# EAGLE design WiiMouseSchematicRev2 (EAGLE 5.07)

## Sheet 1 of 2
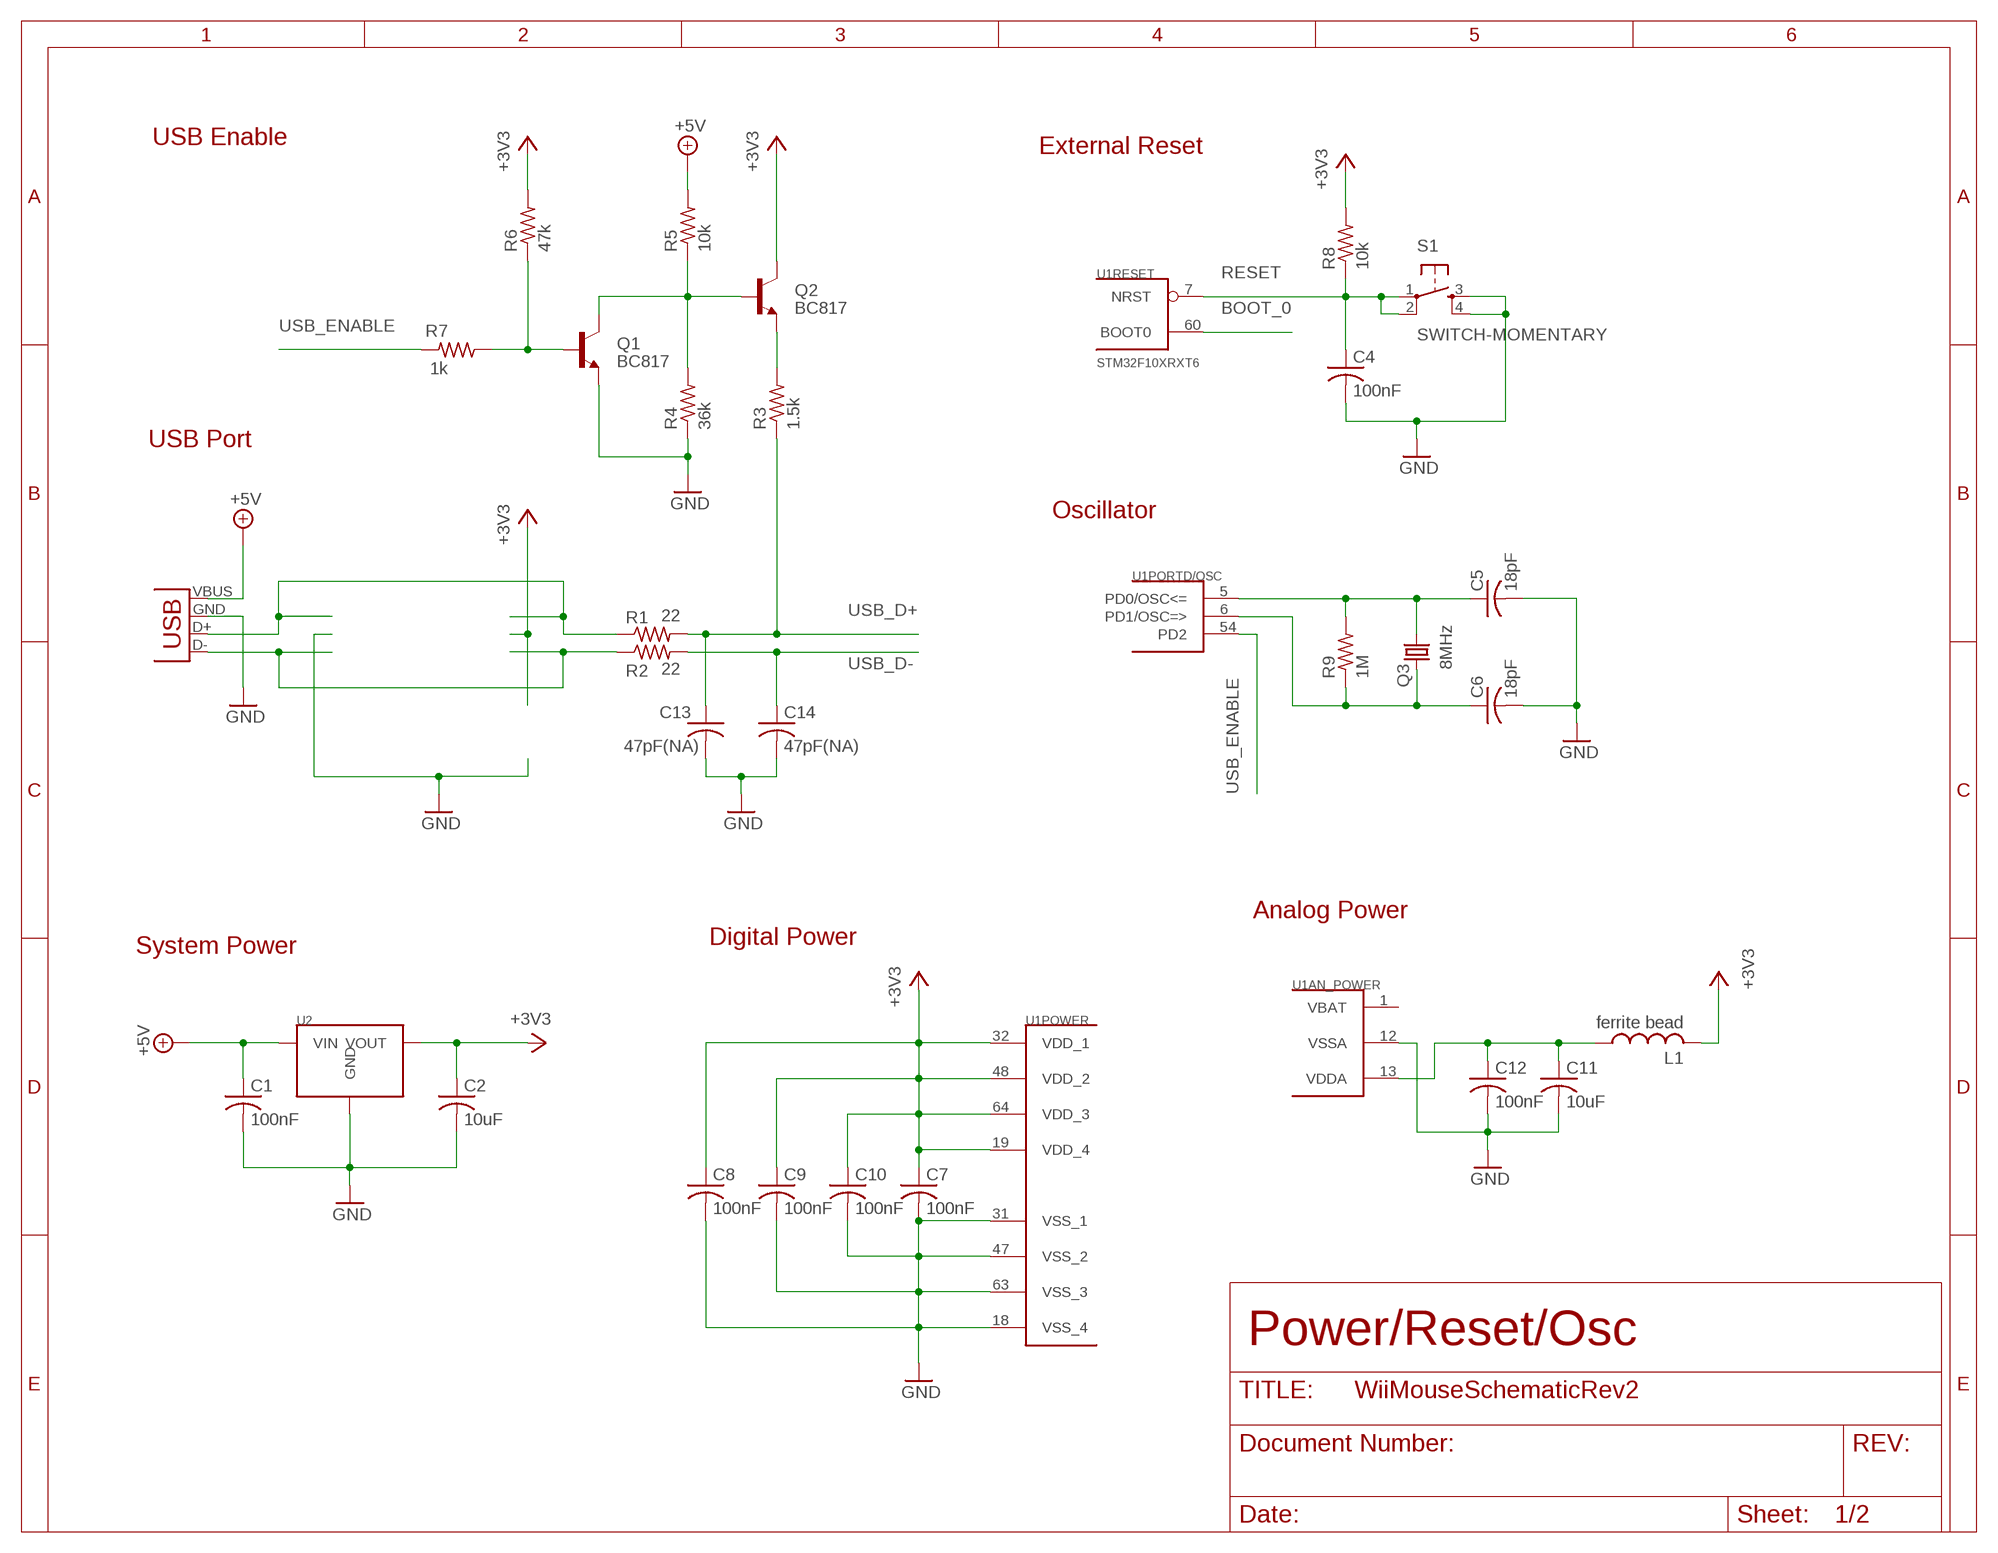
[diagram p0: schematic, sheet 1]

### Parts
C1  100nF  C-USC1206  [C1206]
C2  10uF  C-USC1206  [C1206]
C4  100nF  C-USC1206  [C1206]
C5  18pF  C-USC1206  [C1206]
C6  18pF  C-USC1206  [C1206]
C7  100nF  C-USC1206  [C1206]
C8  100nF  C-USC1206  [C1206]
C9  100nF  C-USC1206  [C1206]
C10  100nF  C-USC1206  [C1206]
C11  10uF  C-USC1206  [C1206]
C12  100nF  C-USC1206  [C1206]
C13  47pF(NA)  C-USC1206  [C1206]
C14  47pF(NA)  C-USC1206  [C1206]
L1  ferrite bead  L-USL3216C  [L3216C]
Q1  BC817  TRANSISTOR_NPNSOT23  [SOT23]
Q2  BC817  TRANSISTOR_NPNSOT23  [SOT23]
Q3  8MHz  CRYSTALHC49UP  [HC49UP]
R1  22  R-US_M1206  [M1206]
R2  22  R-US_M1206  [M1206]
R3  1.5k  R-US_M1206  [M1206]
R4  36k  R-US_M1206  [M1206]
R5  10k  R-US_M1206  [M1206]
R6  47k  R-US_M1206  [M1206]
R7  1k  R-US_M1206  [M1206]
R8  10k  R-US_M1206  [M1206]
R9  1M  R-US_M1206  [M1206]
S1  SWITCH-MOMENTARY  [PUSH-BTN]
U1  STM32F10XRXT6  [TQFP64]
U2  LD1117  [SOT-223]
X1  USB-A-H  [USB-A-H]

### Nets
+3V3: C2.1 C7.1 C8.1 C9.1 C10.1 L1.2 Q2.3(C) R6.2 R8.2 U1.19(POWER:VDD_4) U1.32(POWER:VDD_1) U1.48(POWER:VDD_2) U1.64(POWER:VDD_3) U2.2(VOUT) ; also sheet 2
+5V: C1.1 R5.2 U2.3(VIN) X1.VBUS(GND)
BOOT_0: U1.60(RESET:BOOT0) ; also sheet 2
GND: C1.2 C2.2 C4.2 C5.2 C6.2 C7.2 C8.2 C9.2 C10.2 C11.2 C12.2 C13.2 C14.2 Q1.2(E) R4.1 S1.3 S1.4 U1.12(AN_POWER:VSSA) U1.18(POWER:VSS_4) U1.31(POWER:VSS_1) U1.47(POWER:VSS_2) U1.63(POWER:VSS_3) U2.1(GND) X1.GND(VBUS) ; also sheet 2
N$1: R2.1 X1.D-(D+)
N$2: R1.1 X1.D+(D-)
N$3: Q2.2(E) R3.2
N$4: Q1.3(C) Q2.1(B) R4.2 R5.1
N$5: C5.1 Q3.2 R9.2 U1.5(PORTD/OSC:PD0/OSC<=)
N$6: Q1.1(B) R6.1 R7.1
N$7: C6.1 Q3.1 R9.1 U1.6(PORTD/OSC:PD1/OSC=>)
RESET: C4.1 R8.1 S1.1 S1.2 U1.7(RESET:NRST)
USB_D+: C13.1 R1.2 R3.1 ; also sheet 2
USB_D-: C14.1 R2.2 ; also sheet 2
USB_ENABLE: R7.2 U1.54(PORTD/OSC:PD2)
VDDA: C11.1 C12.1 L1.1 U1.13(AN_POWER:VDDA)

### Notes on the sheet
- USB Enable
- External Reset
- USB Port
- Oscillator
- Analog Power
- Digital Power
- System Power
- Power/Reset/Osc

## Sheet 2 of 2
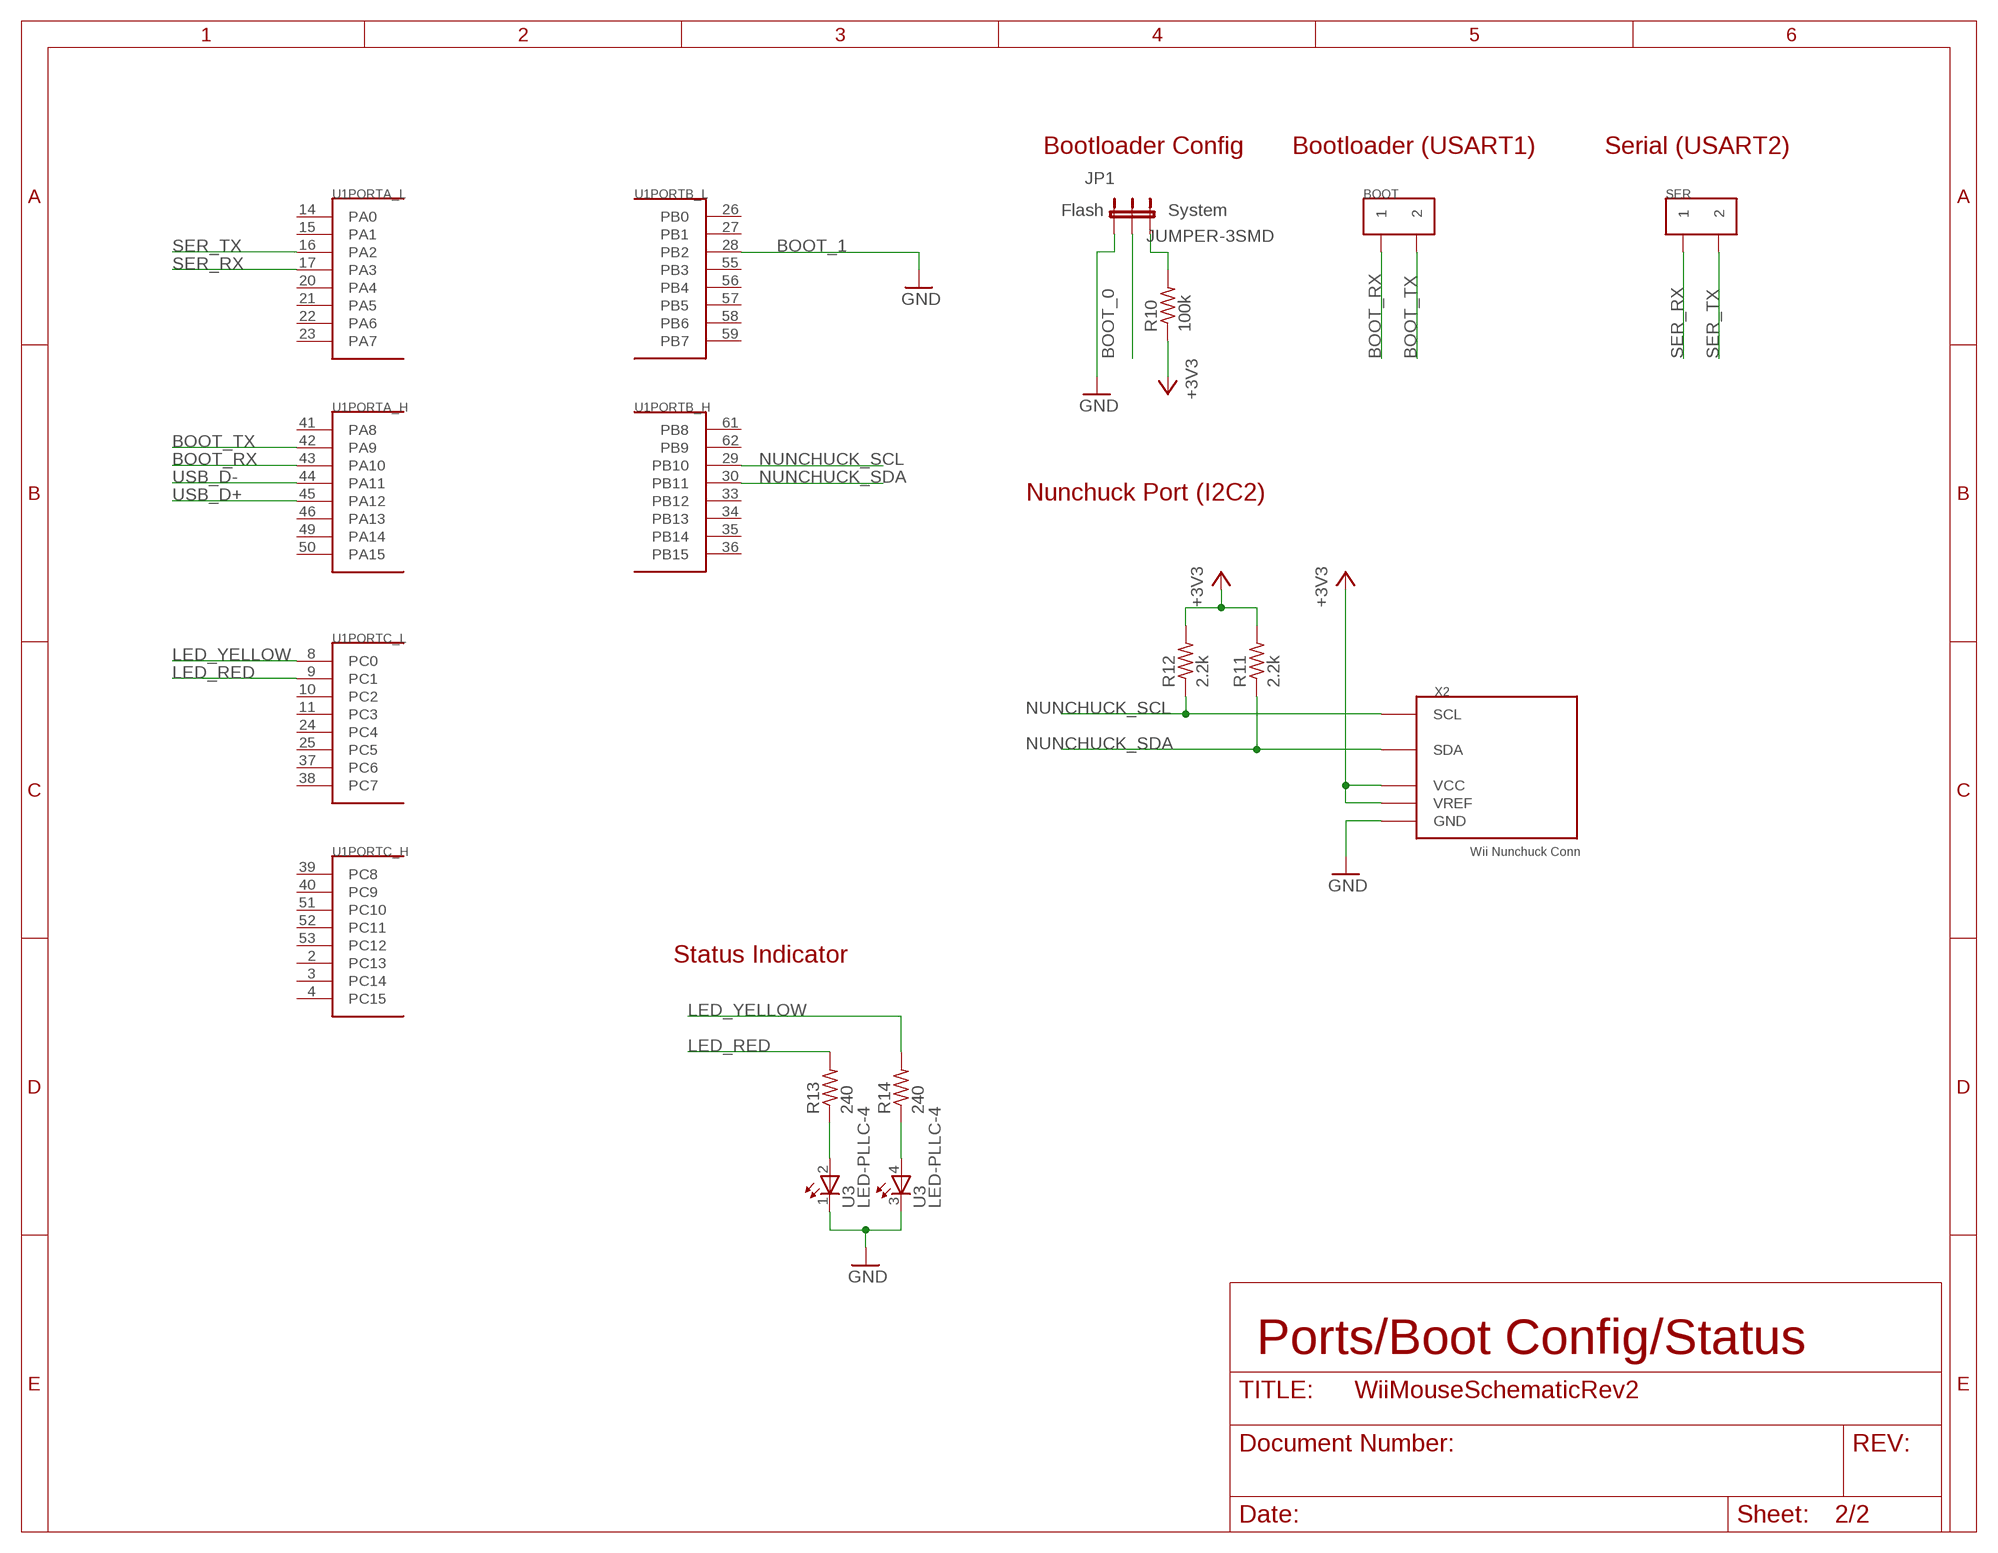
[diagram p1: schematic, sheet 2]

### Parts
BOOT  JUMPER-2-SMD  [JUMPER-2-SMD]
JP1  JUMPER-3SMD  [SJ_3]
R10  100k  R-US_M1206  [M1206]
R11  2.2k  R-US_M1206  [M1206]
R12  2.2k  R-US_M1206  [M1206]
R13  240  R-US_M1206  [M1206]
R14  240  R-US_M1206  [M1206]
SER  JUMPER-2-SMD  [JUMPER-2-SMD]
U3  LED-PLLC-4  [LED-PLCC-4]
X2  WII-NUNCHUCK  [CONN-WII-MOUSE]

### Nets
+3V3: R10.1 R11.2 R12.2 X2.REF_POS(VREF) X2.VCC ; also sheet 1
BOOT_0: JP1.2 ; also sheet 1
BOOT_RX: BOOT.P$1 U1.43(PORTA_H:PA10)
BOOT_TX: BOOT.P$2 U1.42(PORTA_H:PA9)
GND: JP1.1 U1.28(PORTB_L:PB2) U3.1 U3.3 X2.GND ; also sheet 1
LED_RED: R13.2 U1.9(PORTC_L:PC1)
LED_YELLOW: R14.2 U1.8(PORTC_L:PC0)
N$10: R13.1 U3.2
N$11: JP1.3 R10.2
N$12: R14.1 U3.4
NUNCHUCK_SCL: R12.1 U1.29(PORTB_H:PB10) X2.SCL
NUNCHUCK_SDA: R11.1 U1.30(PORTB_H:PB11) X2.SDA
SER_RX: SER.P$1 U1.17(PORTA_L:PA3)
SER_TX: SER.P$2 U1.16(PORTA_L:PA2)
USB_D+: U1.45(PORTA_H:PA12) ; also sheet 1
USB_D-: U1.44(PORTA_H:PA11) ; also sheet 1
Unconnected: U1.2(PORTC_H:PC13) U1.3(PORTC_H:PC14) U1.4(PORTC_H:PC15) U1.10(PORTC_L:PC2) U1.11(PORTC_L:PC3) U1.14(PORTA_L:PA0) U1.15(PORTA_L:PA1) U1.20(PORTA_L:PA4) U1.21(PORTA_L:PA5) U1.22(PORTA_L:PA6) U1.23(PORTA_L:PA7) U1.24(PORTC_L:PC4) U1.25(PORTC_L:PC5) U1.26(PORTB_L:PB0) U1.27(PORTB_L:PB1) U1.33(PORTB_H:PB12) U1.34(PORTB_H:PB13) U1.35(PORTB_H:PB14) U1.36(PORTB_H:PB15) U1.37(PORTC_L:PC6) U1.38(PORTC_L:PC7) U1.39(PORTC_H:PC8) U1.40(PORTC_H:PC9) U1.41(PORTA_H:PA8) U1.46(PORTA_H:PA13) U1.49(PORTA_H:PA14) U1.50(PORTA_H:PA15) U1.51(PORTC_H:PC10) U1.52(PORTC_H:PC11) U1.53(PORTC_H:PC12) U1.55(PORTB_L:PB3) U1.56(PORTB_L:PB4) U1.57(PORTB_L:PB5) U1.58(PORTB_L:PB6) U1.59(PORTB_L:PB7) U1.61(PORTB_H:PB8) U1.62(PORTB_H:PB9)

### Notes on the sheet
- Serial (USART2)
- Bootloader Config | Bootloader (USART1)
- Flash | System
- BOOT_1
- Nunchuck Port (I2C2)
- Status Indicator
- Ports/Boot Config/Status

## Power pins joined to a net without a drawn wire
VBAT: U1.1(AN_POWER:VBAT)

## Library data of the parts
BOOT SER = parts_library:JUMPER-2-SMD
C1 C2 C4-C14 = rcl:C-US: CAPACITOR, American symbol
JP1 = SparkFun:JUMPER-3
L1 = rcl:L-US: INDUCTOR, American symbol
Q1 Q2 = SparkFun:TRANSISTOR_NPN: Transistor NPN BJT configuration in SOT23 package. MMBT2222 is the common NPN we use. Double check BCE configuration again layout.
Q3 = crystal:CRYSTAL: CRYSTAL; OC_FARNELL: unknown; OC_NEWARK: unknown
R1-R14 = resistor:R-US_: RESISTOR, American symbol
S1 = parts_library:SWITCH-MOMENTARY
U1 = stm32:STM32F10XRXT6: STM32F101/103 64pin LQFP
U2 = parts_library:LD1117
U3 = parts_library:LED-PLLC-4
X1 = SparkFun:USB: USB Connectors USB-B-PTH is fully proven SKU : PRT-00139 USB-miniB is fully proven SKU : PRT-00587 USB-A-PCB is untested. USB-A-H is throughly reviewed, but untested. Spark Fun Electronics SKU : PRT-00437 USB-B-SMT is throughly reviewed, but untested. Needs silkscreen touching up. USB-A-S has not been used/tested USB-MB-H has not been used/tested
X2 = parts_library:WII-NUNCHUCK

## Board
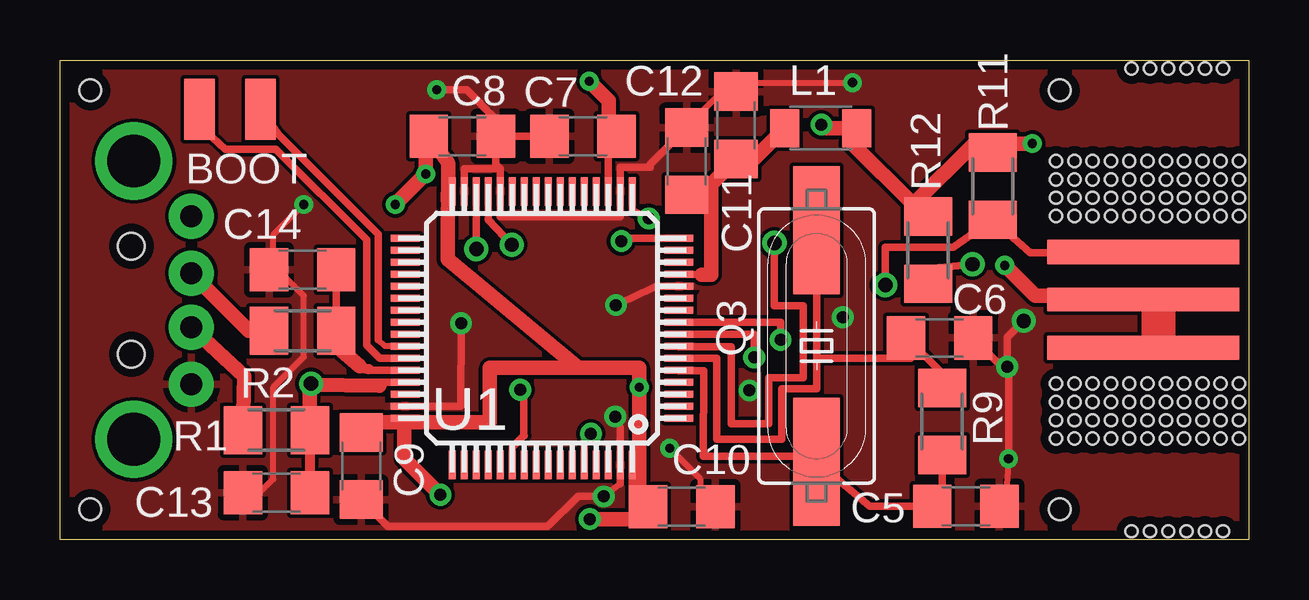
[diagram p2: board, top side]
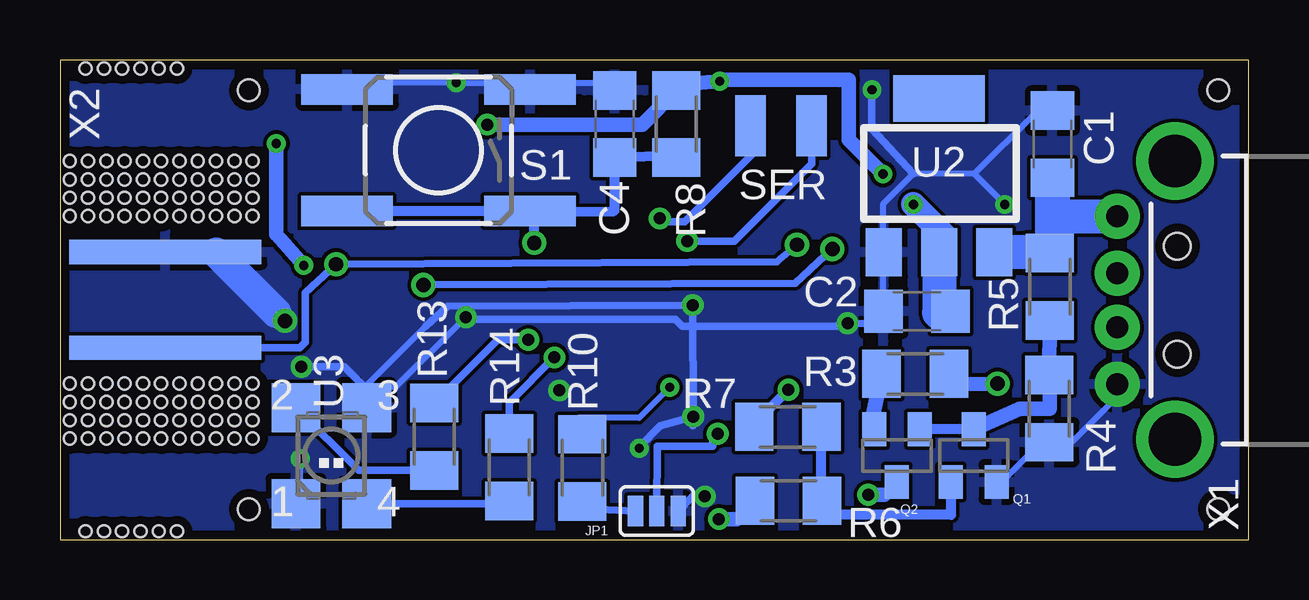
[diagram p3: board, bottom side, seen from below]

Size 49.53 x 19.99 mm. Coordinates in mm from the lower left corner, seen from the top.
Outline: 49.53,0 0,0 0,19.99 49.53,19.99 49.53,0
Copper layers (1*16): Top 0.0356mm / dielectric 1.5011mm / Bottom 0.0356mm
Design rules "typical_4pcb": minimum track width 10mil, minimum drill 15mil, track to track 6mil, track to pad 6mil, pad to pad 6mil, via to via 6mil, smd to smd 6mil, copper to edge 15mil, drill to drill 8mil, minimum pad ring 10mil, minimum via ring 8mil, stop-mask expansion 4mil, vias tented up to drill 0mil, thermal gap 10mil
Holes 0.9 mm at 1.27,18.72 1.27,1.27 41.66,1.27 41.66,18.72

### Footprints (pad centres in the part's own frame; a part is rotated, then mirrored left to right if it is on the bottom)
JUMPER-2-SMD = smd 1.27 x 2.54: P$1 -1.27,0; P$2 1.27,0
C1206 = smd 1.6 x 1.8: 1 -1.4,0; 2 1.4,0
SJ_3 = smd 0.635 x 1.27: 1 -0.889,0; 2 0,0; 3 0.889,0
L3216C = smd 1.2 x 1.6: 1 -1.5,0; 2 1.5,0
SOT23 = smd 1 x 1.4: 1 -0.95,-1.1; 2 0.95,-1.1; 3 0,1.1
HC49UP = smd 5.334 x 1.93: 1 -4.826,0; 2 4.826,0
M1206 = smd 1.6 x 2: 1 -1.4,0; 2 1.4,0
PUSH-BTN = smd 3.81 x 1.27: 1 -3.81,2.54; 2 3.81,2.54; 3 -3.81,-2.54; 4 3.81,-2.54
TQFP64 = smd 1.2 x 0.3: 1 -5.7,3.75; 2 -5.7,3.25; 3 -5.7,2.75; 4 -5.7,2.25; 5 -5.7,1.75; 6 -5.7,1.25; 7 -5.7,0.75; 8 -5.7,0.25; 9 -5.7,-0.25; 10 -5.7,-0.75; 11 -5.7,-1.25; 12 -5.7,-1.75; 13 -5.7,-2.25; 14 -5.7,-2.75; 15 -5.7,-3.25; 16 -5.7,-3.75; 33 5.7,-3.75; 34 5.7,-3.25; 35 5.7,-2.75; 36 5.7,-2.25; 37 5.7,-1.75; 38 5.7,-1.25; 39 5.7,-0.75; 40 5.7,-0.25; 41 5.7,0.25; 42 5.7,0.75; 43 5.7,1.25; 44 5.7,1.75; 45 5.7,2.25; 46 5.7,2.75; 47 5.7,3.25; 48 5.7,3.75 | smd 0.3 x 1.2: 17 -3.75,-5.7; 18 -3.25,-5.7; 19 -2.75,-5.7; 20 -2.25,-5.7; 21 -1.75,-5.7; 22 -1.25,-5.7; 23 -0.75,-5.7; 24 -0.25,-5.7; 25 0.25,-5.7; 26 0.75,-5.7; 27 1.25,-5.7; 28 1.75,-5.7; 29 2.25,-5.7; 30 2.75,-5.7; 31 3.25,-5.7; 32 3.75,-5.7; 49 3.75,5.7; 50 3.25,5.7; 51 2.75,5.7; 52 2.25,5.7; 53 1.75,5.7; 54 1.25,5.7; 55 0.75,5.7; 56 0.25,5.7; 57 -0.25,5.7; 58 -0.75,5.7; 59 -1.25,5.7; 60 -1.75,5.7; 61 -2.25,5.7; 62 -2.75,5.7; 63 -3.25,5.7; 64 -3.75,5.7
SOT-223 = smd 1.499 x 2.007: 1 -2.3,-3.235; 2 0,-3.235; 3 2.3,-3.235 | smd 3.81 x 1.93: 4 0,3.175
LED-PLCC-4 = smd 2.032 x 2.032: 1 -1.473,-2; 2 -1.473,2; 3 1.473,2; 4 1.473,-2
USB-A-H = drill 0.914 pad 1.88 round: D+ 2.4,1.127; D- 2.4,-1.127; GND 2.4,3.5; VBUS 2.4,-3.5 | drill 2.2 round: GND2 0,-5.8; GND3 0,5.8 | hole 1.1: -0.1,2.25; -0.1,-2.25
CONN-WII-MOUSE = smd 1.016 x 8.001: GND 11.989,-4.394; SCL 8.001,-4.394 | smd 0.991 x 8.001 bottom: REF_POS 10.008,-4.394 | smd 1.016 x 8.001 bottom: SDA 11.989,-4.394; VCC 8.001,-4.394 | hole 0.5: 5.74,-0.406; 6.502,-0.406; 0.356,-2.591; 0.356,-4.877; 0.356,-3.353; 0.356,-4.115; 4.978,-0.406; 4.216,-0.406; 5.74,-1.168; 6.502,-1.168; 4.978,-1.168; 4.216,-1.168; 5.74,-1.93; 6.502,-1.93; 4.978,-1.93; 4.216,-1.93; 5.74,-2.692; 6.502,-2.692; 4.978,-2.692; 4.216,-2.692; 5.74,-3.454; 6.502,-3.454; 4.978,-3.454; 4.216,-3.454; 5.74,-4.216; 6.502,-4.216; 4.978,-4.216; 4.216,-4.216; 5.74,-4.978; 6.502,-4.978; 4.978,-4.978; 4.216,-4.978; 5.74,-5.74; 6.502,-5.74; 4.978,-5.74; 4.216,-5.74; 5.74,-6.502; 6.502,-6.502; 4.978,-6.502; 4.216,-6.502; 5.74,-7.264; 6.502,-7.264; 4.978,-7.264; 4.216,-7.264; 5.74,-8.026; 6.502,-8.026; 4.978,-8.026; 4.216,-8.026; 15.011,-0.406; 15.773,-0.406; 14.249,-0.406; 13.487,-0.406; 15.011,-1.168; 15.773,-1.168; 14.249,-1.168; 13.487,-1.168; 15.011,-1.93; 15.773,-1.93; 14.249,-1.93; 13.487,-1.93; 15.011,-2.692; 15.773,-2.692; 14.249,-2.692; 13.487,-2.692; 15.011,-3.454; 15.773,-3.454; 14.249,-3.454; 13.487,-3.454; 15.011,-4.216; 15.773,-4.216; 14.249,-4.216; 13.487,-4.216; 15.011,-4.978; 15.773,-4.978; 14.249,-4.978; 13.487,-4.978; 15.011,-5.74; 15.773,-5.74; 14.249,-5.74; 13.487,-5.74; 15.011,-6.502; 15.773,-6.502; 14.249,-6.502; 13.487,-6.502; 15.011,-7.264; 15.773,-7.264; 14.249,-7.264; 13.487,-7.264; 15.011,-8.026; 15.773,-8.026; 14.249,-8.026; 13.487,-8.026; 19.634,-2.591; 19.634,-4.877; 19.634,-3.353; 19.634,-4.115; 0.356,-1.829; 0.356,-1.067; 19.634,-1.829; 19.634,-1.067

### Placement (x,y rotation side)
BOOT  7.09,17.93 0 top
C1  8.18,16.48 90 bottom
C2  13.82,9.53 180 bottom
C4  26.42,17.32 90 bottom
C5  37.74,1.4 0 top
C6  36.65,8.41 0 top
C7  21.79,16.81 180 top
C8  16.76,16.81 0 top
C9  12.55,3.07 270 top
C10  25.91,1.37 0 top
C11  28.17,17.27 90 top
C12  26.11,15.77 90 top
C13  9.02,1.96 180 top
C14  10.11,11.25 180 top
JP1  24.66,1.19 180 bottom
L1  31.7,17.14 0 top
Q1  11.46,3.51 0 bottom
Q2  14.66,3.51 180 bottom
Q3  31.52,8.08 270 top
R1  9.02,4.57 0 top
R2  10.11,8.71 0 top
R3  13.89,6.91 180 bottom
R4  8.31,5.46 90 bottom
R5  8.28,10.54 90 bottom
R6  19.18,1.63 180 bottom
R7  19.2,4.7 180 bottom
R8  23.85,17.32 90 bottom
R9  36.75,4.93 270 top
R10  27.76,3 270 bottom
R11  38.86,14.73 90 top
R12  36.17,12.06 90 top
R13  33.93,4.29 90 bottom
R14  30.81,3.02 90 bottom
S1  33.76,16.23 180 bottom
SER  19.48,17.25 0 bottom
U1  20.09,8.81 180 top
U2  12.9,15.21 0 bottom
U3  38.23,3.51 0 bottom
X1  3.07,9.98 180 bottom
X2  49.53,0 90 bottom

### Tracks (layer width: path | path; a pad name or v marks a point on that pad's centre or on a via)
+3V3  (via drill 0.38, 0.5)
  Top 0.254: 24.13,1.27 C10.1 | 22.86,16.51 C7.1 | C8.1 15.24,16.51 | L1.2 33.02,16.51 | 38.1,16.51 R11.2 39.37,16.51 | 35.56,13.97 R12.2 | 44.45,10.16 X2.REF_POS 45.72,10.16 | X2.VCC 45.72,7.62
  Top 0.305: C9.1 12.53,5.04 12.96,4.89 U1.48 14.39,4.41 14.35,4.83 | U1.19 22.84,16.46 C7.1 | U1.64 23.84,2.04 C10.1 arc-90 24,0.86 | v31.73,17.3 31.88,17.14 | 14.35,3.38 14.39,3.34 | 16.15,13.76 16.18,13.74 | 16.15,14.43 16.22,14.51 U1.32 16.34,14.6 16.18,14.63 | 16.18,15.68 16.16,15.74 | 45.72,10.16 45.72,9.8 45.77,9.75 | 45.77,8.43 45.72,8.38 45.52,8.38 X2.VCC
  Top 0.61: 16.16,15.74 C8.1 | 24.13,1.27 v24.13,6.35 24.13,7.16 21.59,7.16 | 15.24,16.51 v15.24,15.24 v13.97,13.97 | 33.02,16.51 35.56,13.97 38.1,16.51 | 39.37,16.51 v40.51,16.51 | v39.37,11.43 40.64,10.16 44.45,10.16 | 24,0.86 v22.07,0.86 | 14.39,3.34 v15.85,1.88 | 31.88,17.14 L1.2 | 22.86,16.51 22.86,18.29 v22.05,19.1 | 16.15,13.76 16.15,11.68 21.59,7.16 | 21.59,7.16 17.91,7.16 17.91,4.89 12.96,4.89 | 14.35,4.83 14.35,3.38 | 16.18,13.74 16.15,14.43 | 16.18,14.63 16.18,15.68
  Top 1.422: 45.77,9.75 45.77,8.43
  Bottom 0.254: v24.13,6.35 25.4,5.08 27.94,5.08 R10.1 | 22.86,19.05 R8.2 | 12.7,12.7 U2.2
  Bottom 0.305: 21.34,0.86 R6.2 | 15.18,1.88 Q2.3 | 21.82,19.18 v22.05,19.1
  Bottom 0.61: v22.05,19.1 22.86,19.05 | v40.51,16.51 40.51,12.72 v39.37,11.43 | v22.07,0.86 21.34,0.86 | v15.85,1.88 15.18,1.88 | R8.2 25.28,17.3 v31.73,17.3 | v15.24,15.24 16.66,16.66 16.66,19.18 21.82,19.18
  Bottom 0.813: 12.9,9.47 C2.1
  Bottom 1.016: v13.97,13.97 12.7,12.7
  Bottom 1.422: U2.2 12.9,9.47
+5V
  Bottom 0.813: C1.1 8.18,14.4
  Bottom 1.422: X1.VBUS 8.15,13.48 C1.1 8.18,11.98 8.28,11.98 | 8.28,11.98 U2.3 | R5.2 8.28,11.98
BOOT_0  (via drill 0.5)
  Top 0.305: U1.60 21.84,4.11 v22.12,4.42
  Bottom 0.305: JP1.2 24.64,3.89 22.33,3.89 22.33,4.45 v22.12,4.42
BOOT_RX
  Top 0.305: U1.43 13.31,7.56 12.78,8.1 12.78,12.5 8.99,16.28 6.88,16.28 5.84,17.22 BOOT.P$1
BOOT_TX
  Top 0.254: U1.42 13.55,8.06 13.26,8.33
  Top 0.305: 13.26,8.33 13.26,12.72 9.09,16.89 BOOT.P$2
GND  (via drill 0.38, 0.5, 0.6)
  Top 0.254: 8.89,11.43 10.16,10.16 10.16,7.62 8.89,6.35 8.89,2.54 7.62,1.27 C13.2 | C8.2 17.78,16.51 | v39.52,3.38 39.37,1.27 C5.2 | C9.2 12.7,1.27 | v25.4,3.81 26.67,2.54 26.67,1.27 C10.2 | 8.89,11.43 8.89,12.7 v10.16,13.97 | 8.89,11.43 C14.2 | 27.94,19.05 26.67,17.78 C12.2 | 27.94,19.05 v33.02,19.05 | 27.94,19.05 C11.2 | 23.34,2.34 v22.66,1.8
  Top 0.305: C8.2 C7.2 | U1.31 16.84,15.47 18.34,15.47 | 18.34,15.47 U1.28 18.34,13.46 23.34,13.46 U1.18 23.34,15.52 24.59,15.52 24.59,15.65 C12.2 | v40.16,9.12 39.47,8.43 v39.47,7.21 | C6.2 39.25,7.21 v39.47,7.21 | v39.47,7.21 39.52,7.21 v39.52,3.38 | C9.2 13.66,0.56 20.32,0.56 21.59,1.8 v22.66,1.8 | 23.34,2.34 U1.63 23.34,4.67 v23.14,5.13 | U1.47 16.69,5.56 v16.71,9.02 | 18.34,15.47 18.16,15.64 C8.2 | v15.7,18.75 16.94,18.75 18.14,17.55 18.14,16.84 C8.2 | U1.12 24.84,10.56 v23.16,9.78
  Bottom 0.254: Q1.2 10.16,2.54 8.89,3.81 R4.1 7.62,3.81 5.08,6.35 X1.GND | 11.43,15.24 8.89,17.78 C1.2 | 11.43,15.24 13.97,15.24 15.24,13.97 15.24,12.7 U2.1 15.24,11.43 15.24,10.16 C2.2 | v39.52,3.38 39.57,0.91 U3.1 | 36.83,6.35 34.29,8.89 | v10.16,13.97 11.43,15.24 | C4.2 26.67,19.05 29.21,19.05 S1.3 30.48,19.05 v33.02,19.05 36.83,19.05 S1.4 | 36.83,6.35 35.56,6.35 32.72,9.2 | 36.83,6.35 U3.3 | v16.71,9.02 16.54,8.89
  Bottom 0.305: 43.03,11.99 X2.GND | 36.83,6.35 37.69,7.21 v39.47,7.21 | v22.66,1.8 23.16,1.8 JP1.1 | v25.4,3.81 25.4,3.86 24.51,4.75 v23.14,5.13 | 23.16,4.85 23.16,4.75 v23.14,5.13 | v15.7,18.75 15.7,17.12 13.97,15.24 | v16.71,9.02 15.75,8.99 arc-90 C2.2 | v23.14,5.13 arc-90 23.16,4.85 | v16.71,9.02 arc90 16.64,8.87 | 34.29,8.89 33.38,9.73 v23.16,9.78 v23.14,5.13 | 23.16,4.85 23.14,4.88 v23.14,5.13 | 32.72,9.2 23.9,9.2 23.6,8.89 16.84,8.89 v16.71,9.02
  Bottom 0.406: v40.16,9.12 40.49,9.45 40.51,9.45 | 43.03,11.96 43.03,11.99
  Bottom 1.27: 40.51,9.45 43.03,11.96
  other vias: 32.61,9.27 28.73,6.22
  pour Bottom: 0.25,19.74 49.28,19.74 49.28,0.25 0.25,0.25
  pour Top: 0.25,19.74 49.28,19.74 49.28,0.25 0.25,0.25
LED_RED  (via drill 0.5)
  Top 0.305: U1.9 30.02,9.06 v30.02,8.33
  Bottom 0.305: R13.2 31.3,8.33 v30.02,8.33
LED_YELLOW  (via drill 0.5)
  Top 0.305: U1.8 28.93,8.56 v28.93,7.59
  Bottom 0.305: R14.2 30.81,5.71 v28.93,7.59
N$1
  Top 0.406: R2.1 7.87,8.71
  Top 0.61: 7.87,8.71 X1.D-
N$2
  Top 0.61: X1.D+ 7.67,6.81 R1.1
N$3
  Bottom 0.305: Q2.2 15.75,4.75
  Bottom 0.61: 15.75,4.75 R3.2
N$4
  Bottom 0.406: Q1.3 Q2.1
  Bottom 0.61: R5.1 R4.2 8.28,5.46 9.53,5.46 Q1.3
N$5
  Top 0.305: R9.2 36.75,1.81 C5.1 33.73,1.4 Q3.2 32.21,3.02 32.21,5.11 31.77,3.48 26.8,3.48 26.82,7.04 25.79,7.04 U1.5
N$6
  Bottom 0.305: R6.1 17.8,1.63 17.8,1.04
  Bottom 0.406: Q1.1 12.4,1.04 17.8,1.04 | 17.8,1.63 R7.1
N$7
  Top 0.305: 31.52,7.56 35.45,7.56 C6.1 | R9.1 36.75,6.93 C6.1 | C6.1 34.95,8.46 | 31.52,7.56 Q3.1 | U1.6 27.36,7.56 27.36,4.19 30.08,4.19 30.08,6.3 31.52,6.3 31.52,7.56
N$10
  Bottom 0.305: R13.1 37.09,2.89 U3.2
N$11
  Bottom 0.305: R10.2 27.46,1.29 JP1.3
N$12
  Bottom 0.305: R14.1 30.93,1.5 U3.4
NUNCHUCK_SCL  (via drill 0.6)
  Top 0.305: R12.1 36.6,11.33 v38.02,11.48 | v18.82,12.29 17.84,13.32 U1.29
  Bottom 0.305: v18.82,12.29 19.66,11.58 v38.02,11.48 39.32,10.29 39.32,8.23 39.55,8 X2.SCL
NUNCHUCK_SDA  (via drill 0.6)
  Top 0.305: X2.SDA 45.11,11.96 40.44,11.96 R11.1 37.21,12.19 34.39,12.19 v34.39,10.62 | v17.35,12.12 17.34,13.61 U1.30
  Bottom 0.305: v34.39,10.62 18.9,10.69 v17.35,12.12
RESET  (via drill 0.6)
  Top 0.305: v29.77,12.37 29.77,9.75 30.96,9.75 30.96,6.76 29.54,6.76 29.54,4.83 27.96,4.83 27.96,8.05 U1.7
  Bottom 0.305: 29.77,13.66 S1.1 | 23.88,16.05 R8.1 | 26.44,13.69 26.42,13.72
  Bottom 0.406: v29.77,12.37 29.77,13.66 26.44,13.69 | S1.1 S1.2 | 26.42,13.72 C4.1 23.88,16.05
SER_RX  (via drill 0.5)
  Top 0.305: v24.54,13.39 23.84,13.72 U1.17
  Bottom 0.305: SER.P$1 20.6,16.15 23.5,13.26 24.41,13.26 v24.54,13.39
SER_TX  (via drill 0.5)
  Top 0.305: U1.16 23.51,12.56 arc90 v23.39,12.45
  Bottom 0.305: v23.39,12.45 21.44,12.45 18.21,15.67 SER.P$2
USB_D+  (via drill 0.6)
  Top 0.305: 10.4,6.49 10.59,6.54 v10.46,6.5 arc90 10.41,6.45 | U1.45 13.31,6.56 13.31,6.43
  Top 0.406: C13.1 R1.2
  Top 0.61: R1.2 10.4,6.49 | 10.41,6.45 13.31,6.43
  Bottom 0.305: 12.47,6.48 R3.1
  Bottom 0.61: v10.46,6.5 12.47,6.48
USB_D-
  Top 0.305: C14.1 R2.2 11.46,8.13 | U1.44 12.85,7.06 12.88,7.11 | 12.5,7.24 12.7,7.14
  Top 0.406: 12.7,7.14 12.88,7.11
  Top 0.61: 12.5,7.24 11.46,8.13
USB_ENABLE  (via drill 0.5)
  Top 0.305: 19.33,4.34 19.34,4.34 | 19.33,4.34 19.33,6.1 v19.18,6.25 | U1.54 18.84,3.85 19.33,4.34
  Bottom 0.305: 20.6,4.82 R7.2
  Bottom 0.406: v19.18,6.25 20.6,4.82
VDDA
  Top 0.305: U1.13 26.73,11.05 | 26.85,14.45 27.13,14.81 26.44,14.05 C12.1 26.75,14.4 | C11.1 28.93,15.87
  Top 0.61: 27.13,14.81 27.13,11.05 26.73,11.05 | 26.75,14.4 C11.1 | 28.93,15.87 L1.1

### Text on the board
tDocu: RX | TX | STM32 | F10X
bDocu: RX | TX | This Side Up | BF | BS